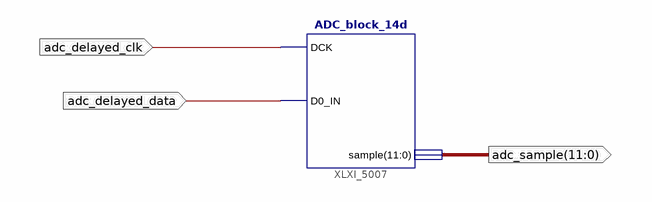
[diagram p0: schematic sheet 1]
// Xilinx ISE schematic ADC_block.sch (virtex4) as structural Verilog: 1 symbols, 3 ports
module ADC_block (
  input  adc_delayed_data,
  input  adc_delayed_clk,
  output [11:0] adc_sample
);

  ADC_block_14d XLXI_5007 (.DCK(adc_delayed_clk), .D0_IN(adc_delayed_data), .sample(adc_sample));
endmodule
